# Altium schematic sheet 4G_CAT1_CN4N40.SchDoc
size A4
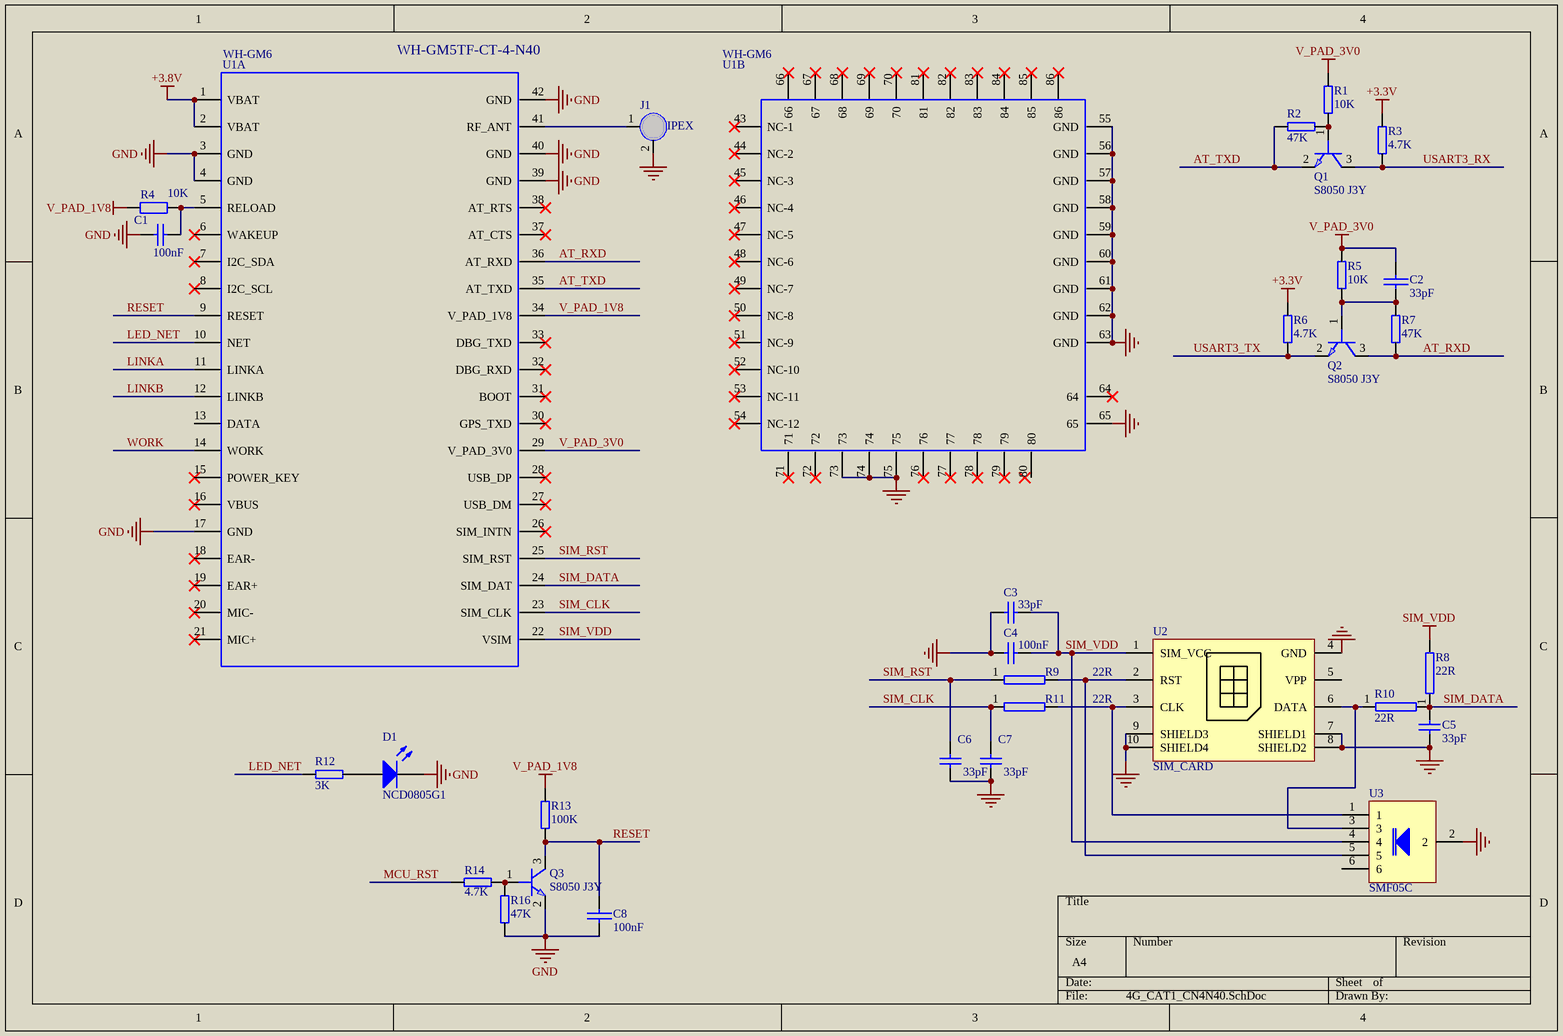
[diagram p0: 4G_CAT1_CN4N40.SchDoc]

## Parts
C1  100nF  [LC-0805_C]
C2  33pF  [LC-0805_C]
C3  33pF  [LC-0805_C]
C4  100nF  [LC-0805_C]
C5  33pF  [LC-0805_C]
C6  33pF  [LC-0805_C]
C7  33pF  [LC-0805_C]
C8  100nF  [LC-0805_C]
D1  NCD0805G1  [LC-0805_LED_S1]
J1  IPEX  [ANT-TH_KH-SMA-K513-G]
Q1  S8050 J3Y  [SOT-23]
Q2  S8050 J3Y  [SOT-23]
Q3  S8050 J3Y  [SOT-23]
R1  10K  [LC-0805_R]
R2  47K  [LC-0805_R]
R3  4.7K  [LC-0805_R]
R4  10K  [LC-0805_R]
R5  10K  [LC-0805_R]
R6  4.7K  [LC-0805_R]
R7  47K  [LC-0805_R]
R8  22R  [LC-0805_R]
R9  22R  [LC-0805_R]
R10  22R  [LC-0805_R]
R11  22R  [LC-0805_R]
R12  3K  [LC-0805_R]
R13  100K  [LC-0805_R]
R14  4.7K  [LC-0805_R]
R16  47K  [LC-0805_R]
U1  WH-GM6  [WH-GM6]  (parts A,B of 2)
U2  SIM_CARD  [SIM_MICRO_6P]
U3  SMF05C  [SOT-363]

## Nets
+3.3V: R3.1 R6.1
+3.8V: U1.1(VBAT) U1.2(VBAT)
GND: C1.1 C3.1 C4.1 C5.2 C6.2 C7.2 C8.2 D1.2(K) J1.2 Q3.2(E) R16.1 U1.3(GND) U1.4(GND) U1.17(GND) U1.39(GND) U1.40(GND) U1.42(GND) U1.55(GND) U1.56(GND) U1.57(GND) U1.58(GND) U1.59(GND) U1.60(GND) U1.61(GND) U1.62(GND) U1.63(GND) U1.65 U1.73 U1.74 U1.75 U2.4(GND) U2.7(SHIELD1) U2.8(SHIELD2) U2.9(SHIELD3) U2.10(SHIELD4) U3.2
SIM_VDD: C3.2 C4.2 R8.2 U1.22(VSIM) U2.1(SIM_VCC) U3.4
V_PAD_1V8: R4.2 R13.2 U1.34(V_PAD_1V8)
V_PAD_3V0: C2.1 R1.1 R5.1 U1.29(V_PAD_3V0)
AT_RXD: Q2.3(C) R7.1 U1.36(AT_RXD)
AT_TXD: Q1.2(E) R2.1 U1.35(AT_TXD)
LED_NET: R12.2 U1.10(NET)
LINKA: U1.11(LINKA)
LINKB: U1.12(LINKB)
MCU_RST: R14.1
RESET: C8.1 Q3.3(C) R13.1 U1.9(RESET)
SIM_CLK: C7.1 R11.1 U1.23(SIM_CLK)
SIM_DATA: C5.1 R8.1 R10.2 U1.24(SIM_DAT)
SIM_RST: C6.1 R9.1 U1.25(SIM_RST)
USART3_RX: Q1.3(C) R3.2
USART3_TX: Q2.2(E) R6.2
WORK: U1.14(WORK)
NetC1_2: C1.2 R4.1 U1.5(RELOAD)
NetC2_2: C2.2 Q2.1(B) R5.2 R7.2
NetD1_1: D1.1(A) R12.1
NetJ1_1: J1.1 U1.41(RF_ANT)
NetQ1_1: Q1.1(B) R1.2 R2.2
NetQ3_1: Q3.1(B) R14.2 R16.2
NetR9_2: R9.2 U2.2(RST) U3.5
NetR10_1: R10.1 U2.6(DATA) U3.3
NetR11_2: R11.2 U2.3(CLK) U3.1

Not connected (* = marked no-connect by the designer): U1 6(WAKEUP)* 7(I2C_SDA)* 8(I2C_SCL)* 13(DATA) 15(POWER_KEY)* 16(VBUS)* 18(EAR-)* 19(EAR+)* 20(MIC-)* 21(MIC+)* 26(SIM_INTN)* 27(USB_DM)* 28(USB_DP)* 30(GPS_TXD)* 31(BOOT)* 32(DBG_RXD)* 33(DBG_TXD)* 37(AT_CTS)* 38(AT_RTS)* 43(NC-1)* 44(NC-2)* 45(NC-3)* 46(NC-4)* 47(NC-5)* 48(NC-6)* 49(NC-7)* 50(NC-8)* 51(NC-9)* 52(NC-10)* 53(NC-11)* 54(NC-12)* 64* 66* 67* 68* 69* 70* 71* 72* 76* 77* 78* 79* 80 81* 82* 83* 84* 85* 86*; U2 5(VPP); U3 6

## Notes on the sheet
- (near U1) WH-GM5TF-CT-4-N40

## Library data of the parts
C1 C2 C4 C8 = CAP: Capacitor
  C1 C4: Published: 8-Jun-2000; Revision: July-2002: Re-released for DXP Platform.; Publisher: Altium Limited; Value: 100nF
C3 C5-C7 = CAP: Capacitor; Value: 100nF; Published: 8-Jun-2000; Revision: July-2002: Re-released for DXP Platform.; Publisher: Altium Limited
D1 = LED2: Typical RED, GREEN, YELLOW, AMBER GaAs LED; Published: 8-Jun-2000; LatestRevisionDate: 17-Jul-2002; LatestRevisionNote: Re-released for DXP Platform.; PackageVersion: Feb-2002; PackageReference: 3.2X1.6X1.1; Publisher: Altium Limited; PackageDescription: SM LED; 2 Flat Leads
Q1-Q3 = 2N5551: Text Field1: 20; Text Field2: 20
R1-R3 R5-R7 R12-R14 R16 = RES22: 1K
R4 = Res2: Resistor; Value: 1K; Published: 8-Jun-2000; LatestRevisionDate: 17-Jul-2002; LatestRevisionNote: Re-released for DXP Platform.; PackageReference: AXIAL-0.4; Publisher: Altium Limited; PackageDescription: Axial Device, Thru-Hole; 2 Leads; 0.4 in Pin Spacing
R8-R11 = RES2
U1 = WH-GM6: PCB DECAL: WH-GM6